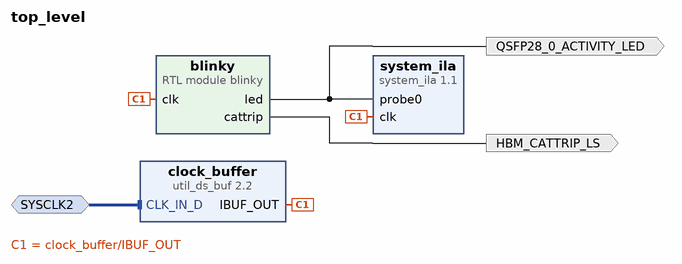
[diagram p0: block diagram of the top level]
# Vivado block design top_level, xcu55c-fsvh2892-2L-e, Vivado 2021.1
create_bd_design top_level

create_bd_intf_port -mode Slave -vlnv xilinx.com:interface:diff_clock_rtl:1.0 SYSCLK2
create_bd_port -dir O QSFP28_0_ACTIVITY_LED
create_bd_port -dir O HBM_CATTRIP_LS

create_bd_cell -type module -reference blinky blinky
create_bd_cell -type ip -vlnv xilinx.com:ip:util_ds_buf:2.2 clock_buffer
create_bd_cell -type ip -vlnv xilinx.com:ip:system_ila:1.1 system_ila
set_property -dict {CONFIG.C_MON_TYPE NATIVE} [get_bd_cells system_ila]

# ---- connections ----

connect_bd_intf_net -intf_net SYSCLK2_1 [get_bd_intf_ports SYSCLK2] [get_bd_intf_pins clock_buffer/CLK_IN_D]
connect_bd_net [get_bd_pins blinky/cattrip] [get_bd_ports HBM_CATTRIP_LS]
connect_bd_net [get_bd_pins blinky/led] [get_bd_ports QSFP28_0_ACTIVITY_LED] [get_bd_pins system_ila/probe0]
connect_bd_net -net util_ds_buf_1_IBUF_OUT [get_bd_pins clock_buffer/IBUF_OUT] [get_bd_pins blinky/clk] [get_bd_pins system_ila/clk]

validate_bd_design
save_bd_design
